# EAGLE design Sound (EAGLE 9.6.2)
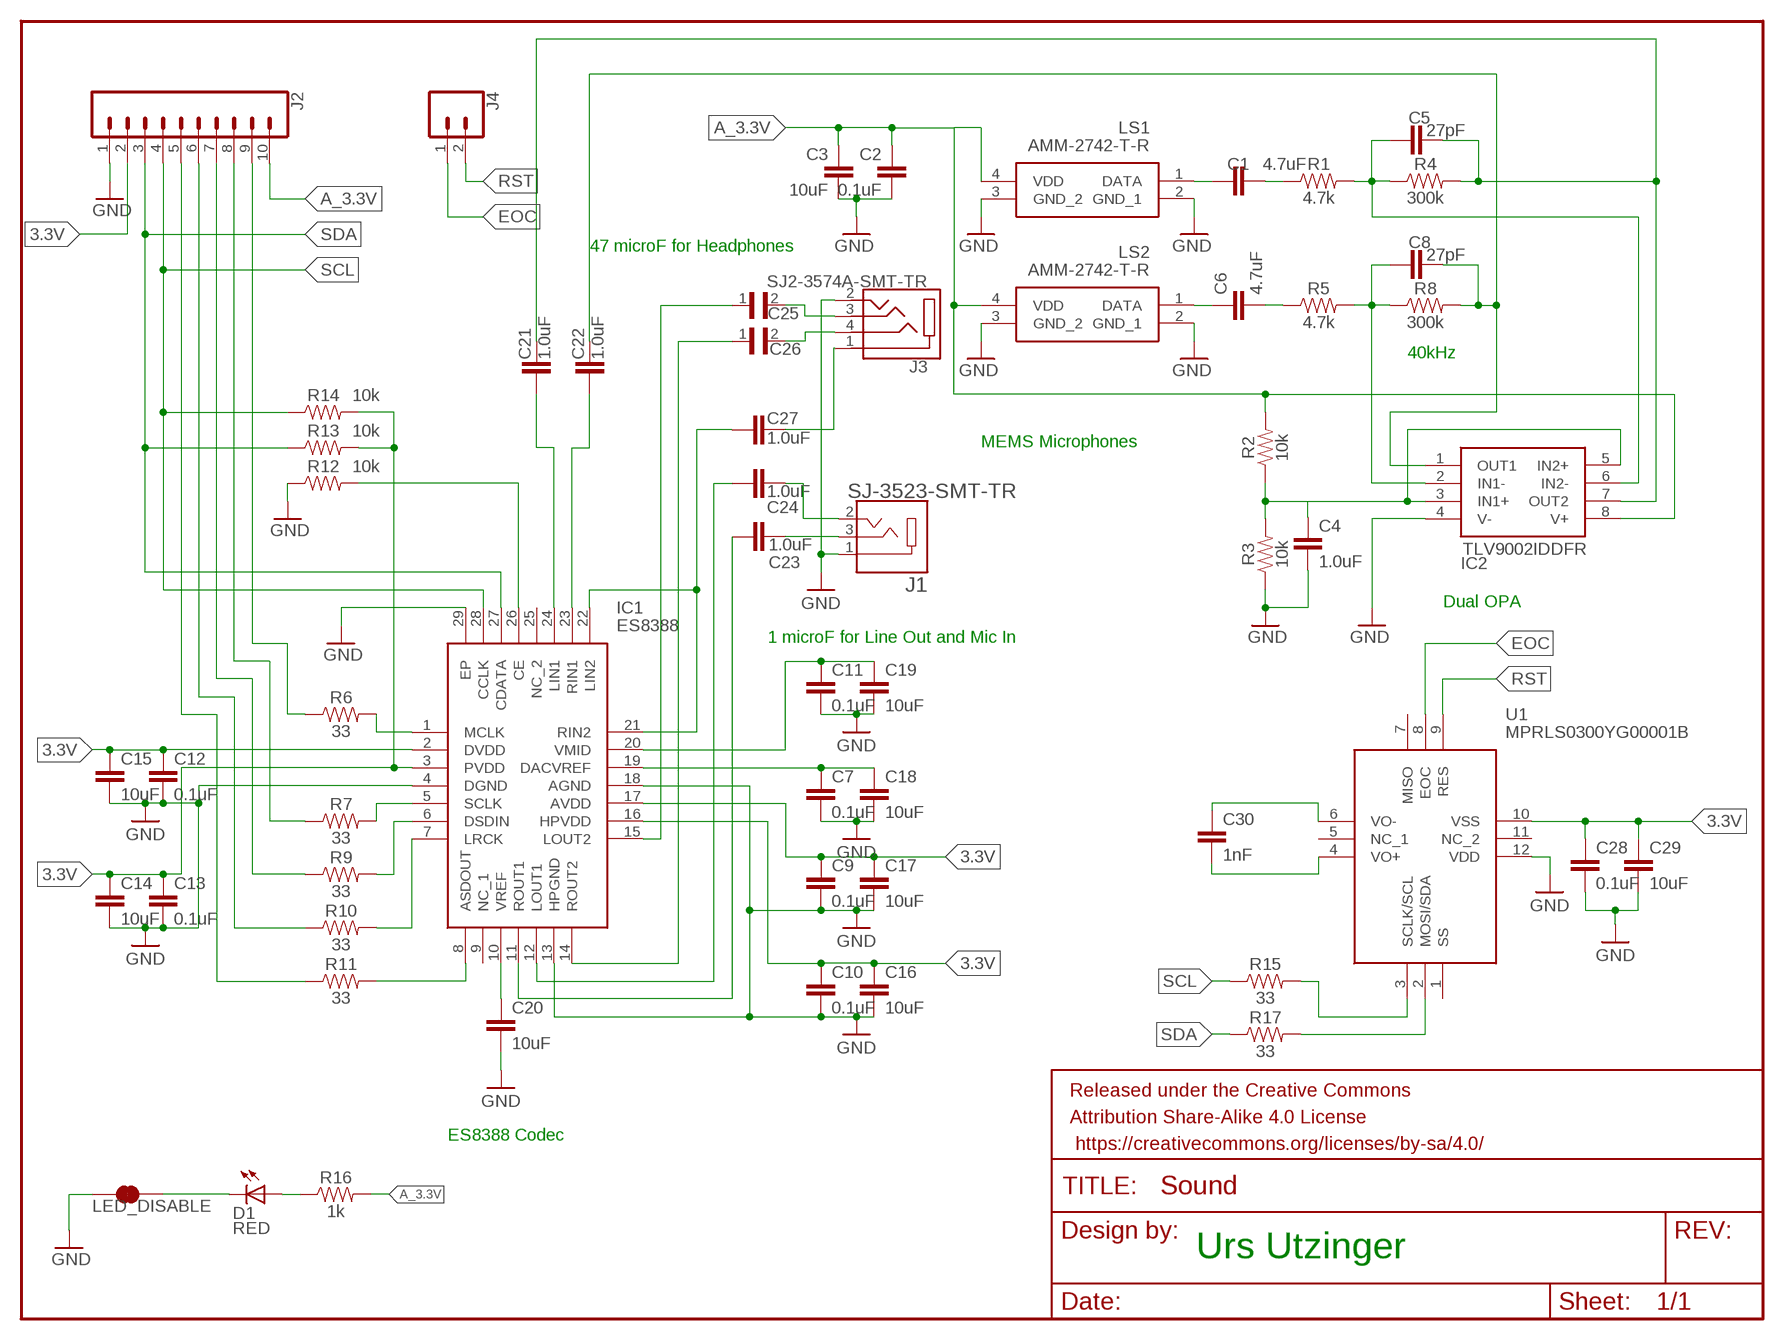
[diagram p0: schematic, sheet 1]

## Parts
C1  4.7uF  4.7UF-0603-6.3V-(10%)  [0603]
C2  0.1uF  0.1UF-0603-25V-5%  [0603]
C3  10uF  10UF-0603-6.3V-20%  [0603]
C4  1.0uF  1.0UF-0603-16V-10%  [0603]
C5  27pF  27PF-0603-50V-5%  [0603]
C6  4.7uF  4.7UF-0603-6.3V-(10%)  [0603]
C7  0.1uF  0.1UF-0603-25V-5%  [0603]
C8  27pF  27PF-0603-50V-5%  [0603]
C9  0.1uF  0.1UF-0603-25V-5%  [0603]
C10  0.1uF  0.1UF-0603-25V-5%  [0603]
C11  0.1uF  0.1UF-0603-25V-5%  [0603]
C12  0.1uF  0.1UF-0603-25V-5%  [0603]
C13  0.1uF  0.1UF-0603-25V-5%  [0603]
C14  10uF  10UF-0603-6.3V-20%  [0603]
C15  10uF  10UF-0603-6.3V-20%  [0603]
C16  10uF  10UF-0603-6.3V-20%  [0603]
C17  10uF  10UF-0603-6.3V-20%  [0603]
C18  10uF  10UF-0603-6.3V-20%  [0603]
C19  10uF  10UF-0603-6.3V-20%  [0603]
C20  10uF  10UF-0603-6.3V-20%  [0603]
C21  1.0uF  1.0UF-0603-16V-10%  [0603]
C22  1.0uF  1.0UF-0603-16V-10%  [0603]
C23  1.0uF  1.0UF-0603-16V-10%  [0603]
C24  1.0uF  1.0UF-0603-16V-10%  [0603]
C25  GRM188R60J476ME15D  [CAPC1608X100N]
C26  GRM188R60J476ME15D  [CAPC1608X100N]
C27  1.0uF  1.0UF-0603-16V-10%  [0603]
C28  0.1uF  0.1UF-0603-25V-5%  [0603]
C29  10uF  10UF-0603-6.3V-20%  [0603]
C30  1nF  1.0NF/1000PF-0603-50V-10%  [0603]
D1  RED  LED-RED0603  [LED-0603]
FRAME1  FRAME-LETTERNO_PACKAGE  [DUMMY]
IC1  ES8388  [QFN45P400X400X90-29N]
IC2  TLV9002IDDFR  [SOT65P280X110-8N]
J1  SJ-3523-SMT-TR  [CUI_SJ-3523-SMT-TR]
J2  CONN_10"  [1X10]
J3  SJ2-3574A-SMT-TR  [CUI_SJ2-3574A-SMT-TR]
J4  CONN_02  [1X02]
LED_DISABLE  JUMPER-SMT_2_NC_TRACE_SILK  [SMT-JUMPER_2_NC_TRACE_SILK]
LS1  AMM-2742-T-R  [AMM2742TR]
LS2  AMM-2742-T-R  [AMM2742TR]
R1  4.7k  4.7KOHM-0603-1/10W-1%  [0603]
R2  10k  10KOHM-0603-1/10W-1%  [0603]
R3  10k  10KOHM-0603-1/10W-1%  [0603]
R4  300k  300KOHM-0603-1/10W-1%  [0603]
R5  4.7k  4.7KOHM-0603-1/10W-1%  [0603]
R6  33  33OHM-0603-1/10W-1%  [0603]
R7  33  33OHM-0603-1/10W-1%  [0603]
R8  300k  300KOHM-0603-1/10W-1%  [0603]
R9  33  33OHM-0603-1/10W-1%  [0603]
R10  33  33OHM-0603-1/10W-1%  [0603]
R11  33  33OHM-0603-1/10W-1%  [0603]
R12  10k  10KOHM-0603-1/10W-1%  [0603]
R13  10k  10KOHM-0603-1/10W-1%  [0603]
R14  10k  10KOHM-0603-1/10W-1%  [0603]
R15  33  33OHM-0603-1/10W-1%  [0603]
R16  1k  1KOHM-0603-1/10W-1%  [0603]
R17  33  33OHM-0603-1/10W-1%  [0603]
U1  MPRLS0300YG00001B  [MPRLS0300YG00001B]

## Nets
3.3V: C9.1 C10.1 C12.1 C13.1 C14.1 C15.1 C16.1 C17.1 C28.1 C29.1 IC1.2(DVDD) IC1.3(PVDD) IC1.16(HPVDD) IC1.17(AVDD) J2.2 R13.2 R14.2 U1.10(VSS)
A_3.3V: C2.1 C3.1 IC2.8(V+) J2.10 LS1.4(VDD) LS2.4(VDD) R2.2 R16.2
DIN: J2.7 R9.1
DOUT: J2.5 R11.1
EOC: J4.1 U1.8(EOC)
GND: C2.2 C3.2 C4.2 C7.2 C9.2 C10.2 C11.2 C12.2 C13.2 C14.2 C15.2 C16.2 C17.2 C18.2 C19.2 C20.2 C28.2 C29.2 IC1.4(DGND) IC1.13(HPGND) IC1.18(AGND) IC1.29(EP) IC2.4(V-) J1.1 J2.1 J3.2 LED_DISABLE.1 LS1.2(GND_1) LS1.3(GND_2) LS2.2(GND_1) LS2.3(GND_2) R3.1 R12.1 U1.12(VDD)
LRCLK: J2.6 R10.1
MCLK: J2.9 R6.1
N$1: IC1.26(CE) R12.2
N$2: C8.2 C22.2 IC2.1(OUT1) R8.2
N$3: C22.1 IC1.23(RIN1)
N$4: C21.1 IC1.24(LIN1)
N$6: R17.2 U1.2(MOSI/SDA)
N$7: R15.2 U1.3(SCLK/SCL)
N$8: C11.1 C19.1 IC1.20(VMID)
N$9: C30.1 U1.6(VO-)
N$10: C5.2 C21.2 IC2.7(OUT2) R4.2
N$11: C30.2 U1.4(VO+)
N$12: C1.1 LS1.1(DATA)
N$14: C1.2 R1.1
N$15: C5.1 IC2.6(IN2-) R1.2 R4.1
N$16: C4.1 IC2.3(IN1+) IC2.5(IN2+) R2.1 R3.2
N$18: C6.1 LS2.1(DATA)
N$19: C6.2 R5.1
N$20: C8.1 IC2.2(IN1-) R5.2 R8.1
N$21: IC1.8(ASDOUT) R11.2
N$22: IC1.7(LRCK) R10.2
N$23: C20.1 IC1.10(VREF)
N$24: IC1.6(DSDIN) R9.2
N$25: IC1.5(SCLK) R7.2
N$26: D1.A R16.1
N$27: IC1.1(MCLK) R6.2
N$28: D1.C LED_DISABLE.2
N$29: C23.2 IC1.11(ROUT1)
N$30: C24.1 J1.2
N$31: C7.1 C18.1 IC1.19(DACVREF)
N$32: C24.2 IC1.12(LOUT1)
N$34: C25.2 J3.3
N$35: C23.1 J1.3
N$36: C26.2 J3.4
N$37: C27.2 J3.1
N$38: C27.1 IC1.21(RIN2) IC1.22(LIN2)
N$39: C26.1 IC1.14(ROUT2)
N$40: C25.1 IC1.15(LOUT2)
RST: J4.2 U1.9(RES)
SCL: IC1.28(CCLK) J2.4 R14.1 R15.1
SCLK: J2.8 R7.1
SDA: IC1.27(CDATA) J2.3 R13.1 R17.1
Unconnected: IC1.9(NC_1) IC1.25(NC_2) U1.1(SS) U1.5(NC_1) U1.7(MISO) U1.11(NC_2)

## Notes on the sheet
- 47 microF for Headphones
- 40kHz
- MEMS Microphones
- Dual OPA
- 1 microF for Line Out and Mic In
- ES8388 Codec
- Urs Utzinger

## Library data of the parts
C1 C6 = SparkFun-Capacitors:4.7UF: 4.7µF ceramic capacitors A capacitor is a passive two-terminal electrical component used to store electrical energy temporarily in an electric field.; PROD_ID: CAP-08280
C2 C7 C9-C13 C28 = SparkFun-Capacitors:0.1UF: 0.1µF ceramic capacitors A capacitor is a passive two-terminal electrical component used to store electrical energy temporarily in an electric field.; PROD_ID: CAP-08604
C3 C14-C20 C29 = SparkFun-Capacitors:10UF: 10.0µF ceramic capacitors A capacitor is a passive two-terminal electrical component used to store electrical energy temporarily in an electric field.; PROD_ID: CAP-11015
C4 C21-C24 C27 = SparkFun-Capacitors:1.0UF: 1µF ceramic capacitors A capacitor is a passive two-terminal electrical component used to store electrical energy temporarily in an electric field.; PROD_ID: CAP-00868
C5 C8 = SparkFun-Capacitors:27PF: 27pF ceramic capacitors A capacitor is a passive two-terminal electrical component used to store electrical energy temporarily in an electric field.; PROD_ID: CAP-09989
C25 C26 = GRM188R60J476ME15D:GRM188R60J476ME15D: SMD Capacitor X5R(EIA) with Capacitance: 47uF Tol. 20%. Rated Voltage: 6.3Vdc
C30 = SparkFun-Capacitors:1.0NF/1000PF: 1nF/1,000pF ceramic capacitors A capacitor is a passive two-terminal electrical component used to store electrical energy temporarily in an electric field.; PROD_ID: CAP-07886
D1 = SparkFun-LED:LED-RED: Assorted Red LEDs LilyPad 1206- DIO-09912 1206- DIO-00809 0603- DIO-00819; PROD_ID: DIO-00819
FRAME1 = SparkFun-Aesthetics:FRAME-LETTER: Schematic Frame - Letter Standard 8.5x11 US Letter frame; DESIGNER: Nobody; VERSION: v01
IC1 = ES8388:ES8388: Low Power Stereo Audio CODEC With Headphone Amplifier Source: Datasheet <http://www.everest-semi.com/pdf/ES8388 DS.pdf>; DESCRIPTION: Low Power Stereo Audio CODEC With Headphone Amplifier; HEIGHT: 0.9mm; MANUFACTURER_NAME: Everest; MANUFACTURER_PART_NUMBER: ES8388
IC2 = TLV9002IDDFR:TLV9002IDDFR: Operational Amplifiers - Op Amps 2-Channel, 1MHz, RRIO, 1.8V to 5.5V Operational Amplifier for Cost-Optimized Systems 8-SOT-23-THIN -40 to 125 Source: Datasheet <https://www.ti.com/lit/gpn/TLV9002>; ARROW_PART_NUMBER: TLV9002IDDFR; ARROW_PRICE-STOCK: https://www.arrow.com/en/products/tlv9002iddfr/texas-instruments?region=europe; DESCRIPTION: Operational Amplifiers - Op Amps 2-Channel, 1MHz, RRIO, 1.8V to 5.5V Operational Amplifier for Cost-Optimized Systems 8-SOT-23-THIN -40 to 125; HEIGHT: 1.1mm; MANUFACTURER_NAME: Texas Instruments; MANUFACTURER_PART_NUMBER: TLV9002IDDFR; MOUSER_PART_NUMBER: 595-TLV9002IDDFR; MOUSER_PRICE-STOCK: https://www.mouser.co.uk/ProductDetail/Texas-Instruments/TLV9002IDDFR?qs=mAH9sUMRCtuVJ6NmNV%252Bgrw%3D%3D
J1 = SJ-3523-SMT-TR:SJ-3523-SMT-TR: Audio Jack Connector 3.5 mm Low Profile Surface Mount Stereo Jack, 3 Pin Right-Angle; MF: CUI Inc; STANDARD: Manufacturer recommendations
J2 = SparkFun-Connectors:CONN_10: Multi connection point. Often used as Generic Header-pin footprint for 0.1 inch spaced/style header connections On any of the 0.1 inch spaced packages, you can populate with these: Break Away Headers - Straight <https://www.sparkfun.com/products/116> (PRT-00116) Break Away Male Headers - Right Angle <https://www.sparkfun.com/products/553> (PRT-00553) Female Headers <https://www.sparkfun.com/products/115> (PRT-00115) Break Away Headers - Machine Pin <https://www.sparkfun.com/products/117> (PRT-00117) Break Away Female Headers - Swiss Machine Pin <https://www.sparkfun.com/products/743> (PRT-00743) Arduino Stackable Header - 10 Pin <https://www.sparkfun.com/products/11376> (PRT-11376) For SCREWTERMINALS and SPRING TERMINALS visit here: Screw Terimnals on SparkFun.com <https://www.sparkfun.com/search/results?term=Screw+Terminals> (5mm/3.5mm/2.54mm spacing) This device is also useful as a general connection point to wire up your design to another part of your project. Our various solder wires solder well into these plated through hole pads. Hook-Up Wire - Assortment (Stranded, 22 AWG) <https://www.sparkfun.com/products/11375> (PRT-11375) Hook-Up Wire - Assortment (Solid Core, 22 AWG) <https://www.sparkfun.com/products/11367> (PRT-11367) View the entire wire category on our website here <https://www.sparkfun.com/categories/141> Special notes: Molex polarized connector foot print use with SKU : PRT-08231 with associated crimp pins and housings. 1MM SMD Version SKU: PRT-10208 NOTES ON THE VARIANTS LOCK and LOCK_LONGPADS... This footprint was designed to help hold the alignment of a through-hole component (i.e. 6-pin header) while soldering it into place. You may notice that each hole has been shifted either up or down by 0.005 of an inch from it's more standard position (which is a perfectly straight line). This slight alteration caused the pins (the squares in the middle) to touch the edges of the holes. Because they are alternating, it causes a "brace" to hold the component in place. 0.005 has proven to be the perfect amount of "off-center" position when using our standard breakaway headers. Although looks a little odd when you look at the bare footprint, once you have a header in there, the alteration is very hard to notice. Also,if you push a header all the way into place, it is covered up entirely on the bottom side.; PROD_ID: CONN-11563
J3 = SJ2-3574A-SMT-TR:SJ2-3574A-SMT-TR: 3.5 mm, Stereo, Right Angle, Surface Mount (SMT), Audio Jack Connector; MANUFACTURER: CUI; MAXIMUM_PACKAGE_HEIGHT: 5.3 mm; PARTREV: 1.02; STANDARD: Manufacturer Recommendations
J4 = SparkFun-Connectors:CONN_02: Multi connection point. Often used as Generic Header-pin footprint for 0.1 inch spaced/style header connections On any of the 0.1 inch spaced packages, you can populate with these: Break Away Headers - Straight <https://www.sparkfun.com/products/116> (PRT-00116) Break Away Male Headers - Right Angle <https://www.sparkfun.com/products/553> (PRT-00553) Female Headers <https://www.sparkfun.com/products/115> (PRT-00115) Break Away Headers - Machine Pin <https://www.sparkfun.com/products/117> (PRT-00117) Break Away Female Headers - Swiss Machine Pin <https://www.sparkfun.com/products/743> (PRT-00743) For SCREWTERMINALS and SPRING TERMINALS visit here: Screw Terimnals on SparkFun.com <https://www.sparkfun.com/search/results?term=Screw+Terminals> (5mm/3.5mm/2.54mm spacing) This device is also useful as a general connection point to wire up your design to another part of your project. Our various solder wires solder well into these plated through hole pads. Hook-Up Wire - Assortment (Stranded, 22 AWG) <https://www.sparkfun.com/products/11375> (PRT-11375) Hook-Up Wire - Assortment (Solid Core, 22 AWG) <https://www.sparkfun.com/products/11367> (PRT-11367) View the entire wire category on our website here <https://www.sparkfun.com/categories/141> Special notes: Molex polarized connector foot print use with: PRT-08233 with associated crimp pins and housings. 2.54_SCREWTERM for use with PRT-10571. 3.5mm Screw Terminal footprints for PRT-08084 5mm Screw Terminal footprints for use with PRT-08432
LED_DISABLE = SparkFun-Jumpers:JUMPER-SMT_2_NC_TRACE: Normally closed trace jumper This jumper has a trace between two pads so it's normally closed (NC). Use a razor knife to open the connection. For best results follow the IPC guidelines for cutting traces: Cutout at least 0.063 mm (0.005 in). Remove all loose material to clean up the cut area. Seal the cut with an approved epoxy. Reapply solder to reclose the connection.
LS1 LS2 = AMM-2742-T-R:AMM-2742-T-R: Microphones MICROPHONE OMNI -42 DB 2VDC 150uA Source: Datasheet <https://www.mouser.ca/ProductDetail/PUI-Audio/AMM-2742-T-R?qs=sGAEpiMZZMtcsMZaWNSqu0WLuZO5KII9g8HRN6KfqAJAYTCxL65m3w==>; DESCRIPTION: Microphones MICROPHONE OMNI -42 DB 2VDC 150uA; HEIGHT: 0.9mm; MANUFACTURER_NAME: PUI Audio; MANUFACTURER_PART_NUMBER: AMM-2742-T-R; MOUSER_PART_NUMBER: 665-AMM-2742-T-R; MOUSER_PRICE-STOCK: https://www.mouser.co.uk/ProductDetail/PUI-Audio/AMM-2742-T-R?qs=zhx2xqPtQQyJoGop0O%252BpMA%3D%3D
R1 R5 = SparkFun-Resistors:4.7KOHM: 4.7kΩ resistor A resistor is a passive two-terminal electrical component that implements electrical resistance as a circuit element. Resistors act to reduce current flow, and, at the same time, act to lower voltage levels within circuits. - Wikipedia; PROD_ID: RES-07857
R2 R3 R12-R14 = SparkFun-Resistors:10KOHM: 10kΩ resistor A resistor is a passive two-terminal electrical component that implements electrical resistance as a circuit element. Resistors act to reduce current flow, and, at the same time, act to lower voltage levels within circuits. - Wikipedia; PROD_ID: RES-00824
R4 R8 = SparkFun-Resistors:300KOHM: 300kΩ resistor A resistor is a passive two-terminal electrical component that implements electrical resistance as a circuit element. Resistors act to reduce current flow, and, at the same time, act to lower voltage levels within circuits. - Wikipedia; PROD_ID: RES-10809
R6 R7 R9-R11 R15 R17 = SparkFun-Resistors:33OHM: 33Ω resistor A resistor is a passive two-terminal electrical component that implements electrical resistance as a circuit element. Resistors act to reduce current flow, and, at the same time, act to lower voltage levels within circuits. - Wikipedia; PROD_ID: RES-08270
R16 = SparkFun-Resistors:1KOHM: 1kΩ resistor A resistor is a passive two-terminal electrical component that implements electrical resistance as a circuit element. Resistors act to reduce current flow, and, at the same time, act to lower voltage levels within circuits. - Wikipedia; PROD_ID: RES-07856
U1 = MPRLS0300YG00001B:MPRLS0300YG00001B: Board Mount Pressure Sensors Source: Datasheet <https://sensing.honeywell.com/honeywell-sensing-micropressure-board-mount-pressure-mpr-series-datasheet-32332628-c-en.pdf>; DESCRIPTION: Board Mount Pressure Sensors; HEIGHT: 5mm; MANUFACTURER_NAME: Honeywell; MANUFACTURER_PART_NUMBER: MPRLS0300YG00001B; MOUSER_PART_NUMBER: 785-MPRLS0300YG0001B; MOUSER_PRICE-STOCK: https://www.mouser.co.uk/ProductDetail/Honeywell/MPRLS0300YG00001B?qs=MLItCLRbWszf0bln%252B%2FiVCQ%3D%3D

## Board
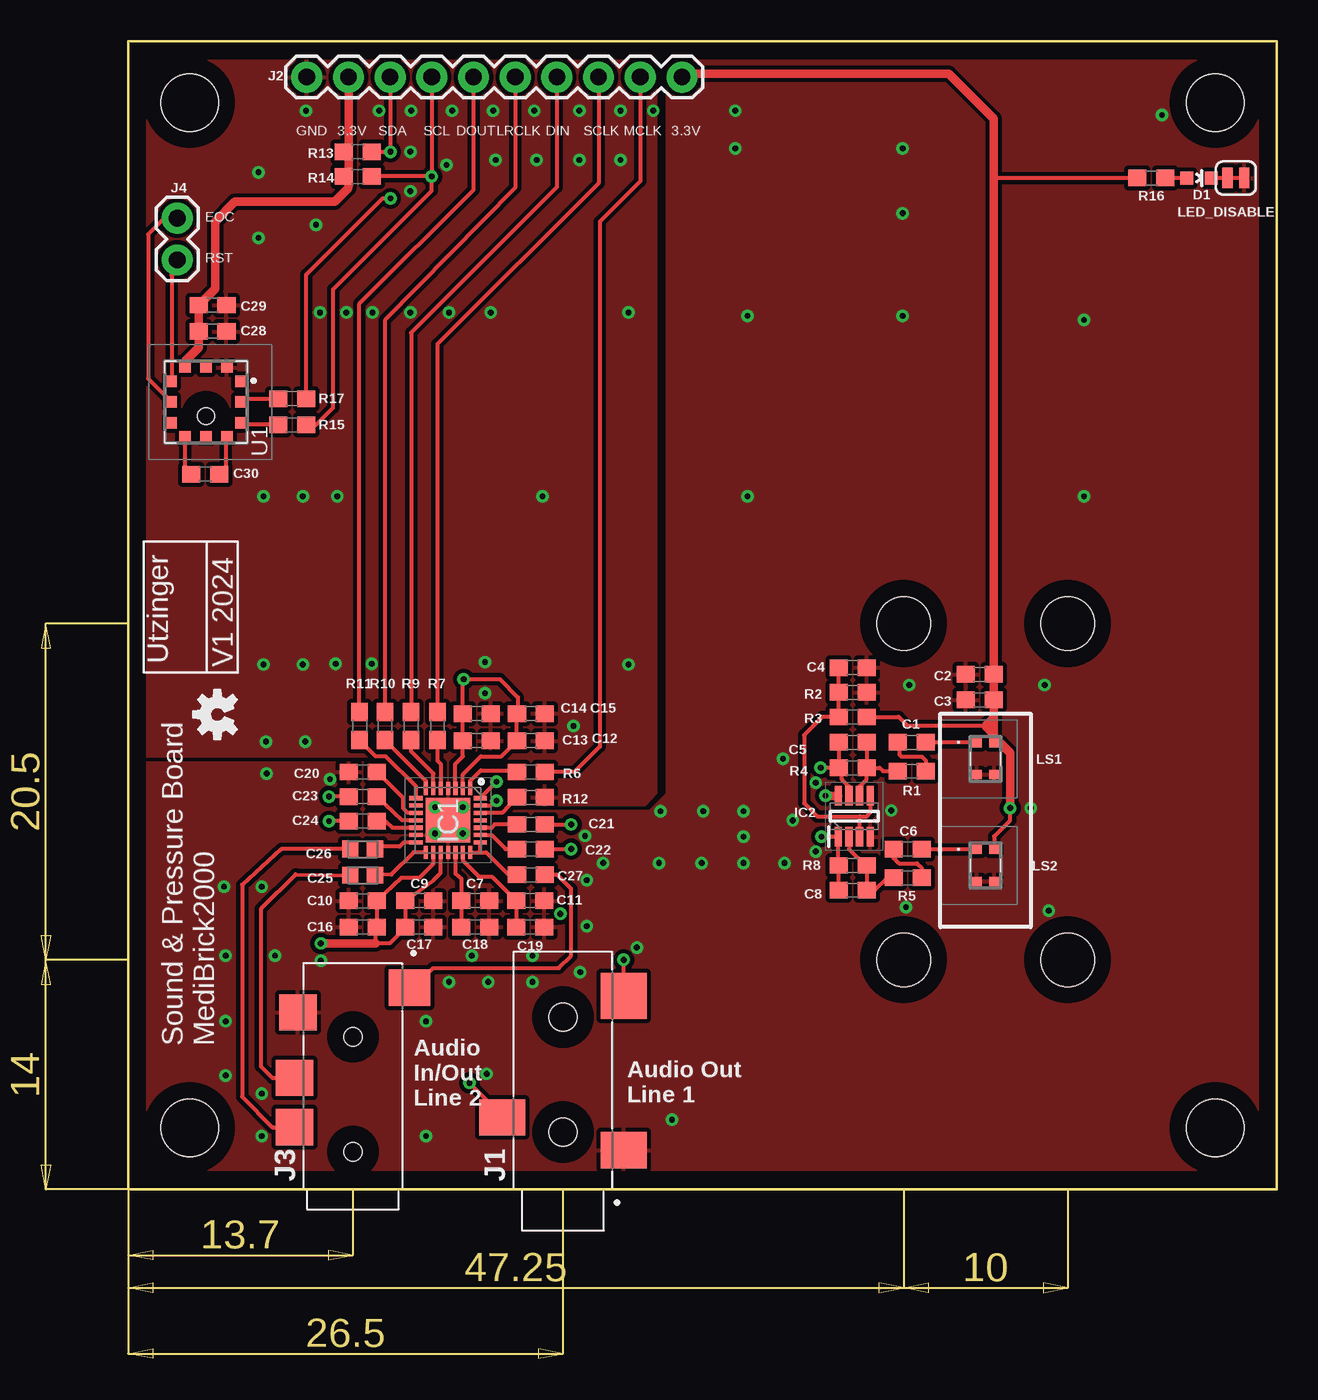
[diagram p1: board, top side]
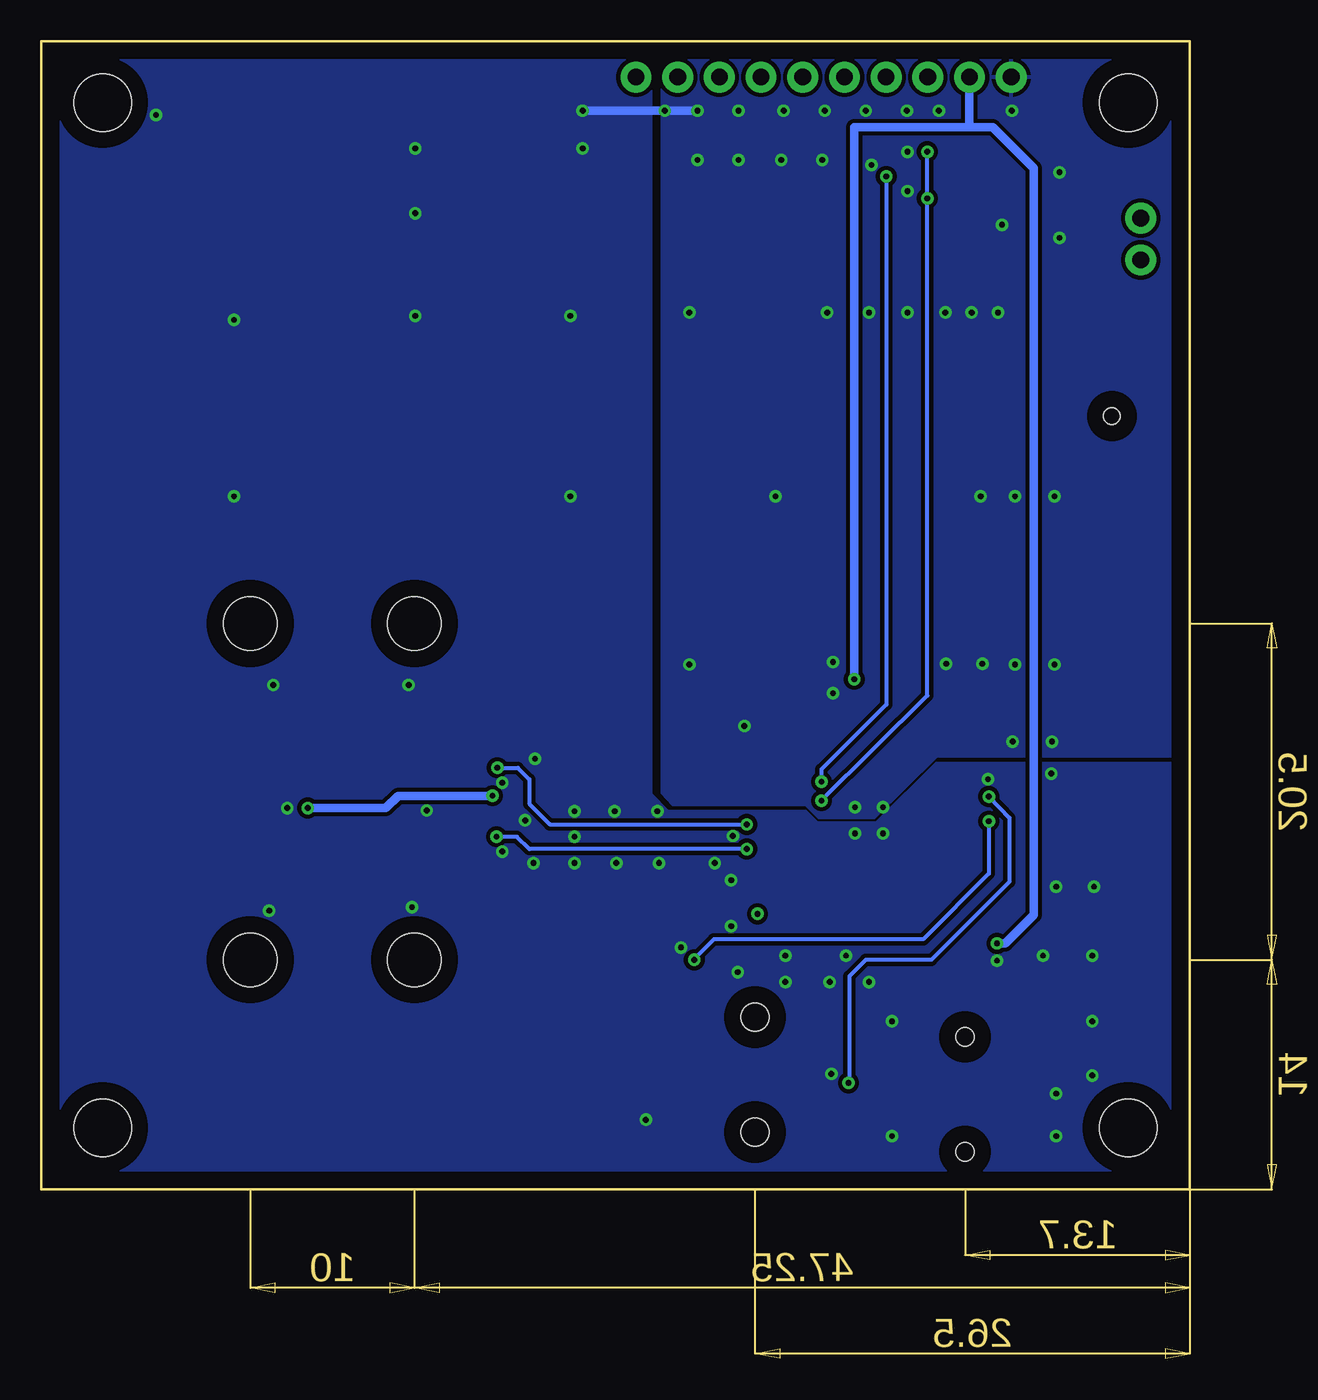
[diagram p2: board, bottom side, seen from below]

Size 70 x 70 mm. Coordinates in mm from the lower left corner, seen from the top.
Outline: 0,0 0,70 70,70 70,0 0,0
Copper layers (1*16): Top 0.035mm / dielectric 1.5mm / Bottom 0.035mm
Design rules "default": minimum track width 6mil, minimum drill 0.35mm, track to track 6mil, track to pad 6mil, pad to pad 6mil, via to via 6mil, smd to smd 6mil, copper to edge 40mil, drill to drill 6mil, minimum pad ring 10mil, minimum via ring 8mil, stop-mask expansion 4mil, vias tented up to drill 0mil, thermal gap 10mil
Holes 3.5 mm at 3.75,66.25 66.25,66.25 66.25,3.75 3.75,3.75
Holes 3.25 mm at 47.25,14 57.25,14 57.25,34.5 47.25,34.5

### Footprints (pad centres in the part's own frame; a part is rotated, then mirrored left to right if it is on the bottom)
0603 = smd 1.1 x 1: 1 -0.85,0; 2 0.85,0
CAPC1608X100N = smd 1 x 1.02: 1 -0.759,0; 2 0.759,0
LED-0603 = smd 0.8 x 0.8: A 0,-0.75; C 0,0.75
QFN45P400X400X90-29N = smd 0.8 x 0.25: 1 -1.95,1.35; 2 -1.95,0.9; 3 -1.95,0.45; 4 -1.95,0; 5 -1.95,-0.45; 6 -1.95,-0.9; 7 -1.95,-1.35; 15 1.95,-1.35; 16 1.95,-0.9; 17 1.95,-0.45; 18 1.95,0; 19 1.95,0.45; 20 1.95,0.9; 21 1.95,1.35 | smd 0.25 x 0.8: 8 -1.35,-1.95; 9 -0.9,-1.95; 10 -0.45,-1.95; 11 0,-1.95; 12 0.45,-1.95; 13 0.9,-1.95; 14 1.35,-1.95; 22 1.35,1.95; 23 0.9,1.95; 24 0.45,1.95; 25 0,1.95; 26 -0.45,1.95; 27 -0.9,1.95; 28 -1.35,1.95 | smd 2.7 x 2.7: 29 0,0
SOT65P280X110-8N = smd 1.2 x 0.45: 1 -1.25,0.975; 2 -1.25,0.325; 3 -1.25,-0.325; 4 -1.25,-0.975; 5 1.25,-0.975; 6 1.25,-0.325; 7 1.25,0.325; 8 1.25,0.975
CUI_SJ-3523-SMT-TR = smd 2.2 x 2.8: 1 -1.1,-3.7; 3 0.9,3.7 | smd 2.8 x 2.8: 2 8.3,-3.7 | hole 1.7: 0,0; 7,0
1X10 = drill 1.016 pad 1.88: 1 0,0; 2 2.54,0; 3 5.08,0; 4 7.62,0; 5 10.16,0; 6 12.7,0; 7 15.24,0; 8 17.78,0; 9 20.32,0; 10 22.86,0
CUI_SJ2-3574A-SMT-TR = smd 2.2 x 2.5: 1 6,-3.45 | smd 2.2 x 2.3: 2 4.5,3.35; 3 0.5,3.55; 4 -2.5,3.55 | hole 1.1: -4,0; 3,0
1X02 = drill 1.016 pad 1.88: 1 0,0; 2 2.54,0
SMT-JUMPER_2_NC_TRACE_SILK = smd 0.635 x 1.27: 1 -0.508,0; 2 0.508,0
AMM2742TR = smd 0.6 x 0.54: 1 -0.525,0.965; 2 -0.525,-0.965; 3 0.525,-0.965; 4 0.525,0.965
MPRLS0300YG00001B = smd 0.7 x 0.65: 1 1.27,-1.85; 2 0,-1.85; 3 -1.27,-1.85; 7 -1.27,2.35; 8 0,2.35; 9 1.27,2.35 | smd 0.65 x 0.7: 4 -2.1,-1.02; 5 -2.1,0.25; 6 -2.1,1.52; 10 2.1,1.52; 11 2.1,0.25; 12 2.1,-1.02 | hole 1: -0.86,0.25

### Placement (x,y rotation side)
C1  47.75,27.25 180 top
C2  51.9,31.4 180 top
C3  51.9,29.85 180 top
C4  44.15,31.8 0 top
C5  44.15,27.25 180 top
C6  47.5,20.75 180 top
C7  21.15,17.6 0 top
C8  44.15,18.25 180 top
C9  17.75,17.6 0 top
C10  14.3,17.6 180 top
C11  24.5,17.6 0 top
C12  24.55,27.35 0 top
C13  21.25,27.35 0 top
C14  21.25,29 0 top
C15  24.55,29 0 top
C16  14.3,16 180 top
C17  17.75,16 0 top
C18  21.15,16 0 top
C19  24.5,16 0 top
C20  14.3,25.45 180 top
C21  24.55,22.25 0 top
C22  24.55,20.75 0 top
C23  14.3,23.95 0 top
C24  14.3,22.45 0 top
C25  14.3,19.15 180 top
C26  14.3,20.75 180 top
C27  24.55,19.18 0 top
C28  5.15,52.3 0 top
C29  5.15,53.9 0 top
C30  4.7,43.6 0 top
D1  65.25,61.65 270 top
FRAME1  -0.25,-5.25 0 top  (outside the outline)
IC1  19.5,22.5 270 top
IC2  44.25,22.75 90 top
J1  26.5,3.5 90 top
J2  10.89,67.8 0 top
J3  13.7,6.3 90 top
J4  3,59.2 270 top
LED_DISABLE  67.5,61.65 180 top
LS1  52.25,26.25 0 top
LS2  52.25,19.75 0 top
R1  47.75,25.5 180 top
R2  44.15,28.8 0 top
R3  44.15,30.3 180 top
R4  44.15,25.7 180 top
R5  47.5,19 180 top
R6  24.55,25.45 180 top
R7  18.85,28.25 270 top
R8  44.15,19.75 180 top
R9  17.25,28.25 270 top
R10  15.65,28.25 270 top
R11  14.1,28.25 270 top
R12  24.55,23.9 180 top
R13  14,63.25 180 top
R14  14,61.75 180 top
R15  10,46.6 180 top
R16  62.35,61.65 180 top
R17  10,48.2 180 top
U1  5,48 90 top
U$3  [OSHW-LOGO-S]  5.45,28.95 90 top

### Tracks (layer width: path | path; a pad name or v marks a point on that pad's centre or on a via)
3.3V  (via drill 0.35)
  Top 0.254: IC1.17 19.05,19.3 18.6,18.85 C9.1 C17.1 16.94,15.99 15.95,15 15.1,15 15.1,15.95 | IC1.16 18.6,19.85 17.75,19 16.65,19 C10.1 C16.1 | IC1.3 19.95,25.95 20.4,26.4 C13.1 C14.1 20.4,31.05 | v20.45,31.1 22.65,31.1 23.75,30 23.75,29.05 | IC1.2 20.4,25.3 21.5,26.4 22.75,26.4 C12.1 C15.1 | R14.2 13.15,61.8 | R13.2 13.45,63.55 | J2.2 13.45,67.78
  Top 0.508: 20.4,31.05 v20.45,31.1 | 23.75,29.05 C15.1 | 15.1,15.95 C16.1 | 15.1,15 v11.75,15 | 13.15,61.8 13.45,62.1 | 13.45,62.1 13.45,62.95 R13.2 | 13.45,67.78 13.45,63.55 | U1.10 3.48,50.48 4.3,51.3 C28.1 C29.1 5.3,54.9 5.3,59 6.5,60.2 12.6,60.2 13.43,61.03 13.45,61.25 13.45,62.1
  Bottom 0.508: v11.75,15 11.25,15 9.5,16.75 9.5,62.25 12,64.75 13.61,64.75 | J2.2 13.43,64.93 13.61,64.75 | v20.45,31.1 20.45,64.75 13.61,64.75
A_3.3V  (via drill 0.35)
  Top 0.254: 52.25,28.25 47.5,28.25 46.95,28.8 R2.2 | v53.75,23.25 53.75,22.5 52.77,21.52 LS2.4 | 52.75,61.6 52.8,61.65 R16.2
  Top 0.508: 52.25,28.25 52.75,28.25 | 52.75,28.75 52.25,28.25 | v53.75,23.25 53.75,26.6 53.13,27.21 LS1.4 52.75,27.75 | 52.75,28.75 C3.1 C2.1 52.75,61.6 52.75,65.25 50,68 33.95,68 J2.10 | 52.75,28.25 52.75,27.75 | 52.75,28.25 52.75,28.75 | 52.25,28.25 52.75,27.75 | IC2.8 v42.5,24
  Bottom 0.508: v42.5,24 48.25,24 49,23.25 v53.75,23.25
DIN
  Top 0.254: J2.7 26.13,61.1 17.25,52.22 R9.1
DOUT
  Top 0.254: R11.1 14.1,54 21.05,60.95 J2.5
EOC
  Top 0.254: J4.1 2.2,59.2 1.22,58.22 1.22,49.43 U1.8
GND  (via drill 0.35)
  Bottom 0.508: v30,65.75 v37,65.75
  other vias: 7.95,62 8.25,42.25 8.25,32 8.4,27.3 58.25,42.25 58.25,53 63,65.5 10.85,65.75 17.25,65.75 19.75,65.75 22.25,65.75 24.75,65.75 27.5,65.75 37.5,21.5 37.5,23.05 47.6,30.75 37.5,19.9 37.75,53.25 37.75,42.25 47.2,53.25 47.2,59.5 47.4,17.2 56.1,17 55,23.25 55.85,30.75 30.5,53.45 30.5,32 25.25,42.25 12.75,42.25 15.3,65.75 27.5,62.75 30,62.75 24.9,62.75 22.4,62.75 14.9,53.45 12.65,32.05 14.85,32.05 21.75,32.15 27.15,28.25 28.95,19.9 21.95,12.65 18.15,10.25 5.95,10.25 18.15,3.25 8.15,3.25 33.15,4.25 32,65.75 46.5,23.1 8.15,5.85 8.15,18.45 5.85,18.45 5.95,6.95 21.75,30.25 18.7,21.7 20.4,21.7 20.4,23.3 18.7,23.3 10.8,27.3 10.65,32 10.65,42.25 11.45,58.8 37,63.45 17.2,63.25 19.4,62.45 47.2,63.45 12.3,25 11.75,13.95 31,14.75 21.85,7.05 27.85,21.55 41.9,24.8 41.9,20.6 32.35,19.9 34.95,19.9 35.05,23.05 32.45,23.05 40.5,22.5 39.9,26.25 40,19.9 5.95,14.25 8.95,14.25 27.55,13.25 27.95,18.85 27.95,16.05 24.65,12.65 19.55,12.65 20.95,14.25 24.65,14.25 8.45,25.35 7.95,58 13.3,53.45 11.7,53.45 17.2,53.45 19.55,53.45 22.1,53.45 17.2,60.85
  pour Bottom (isolate 0.254): 32.8,70 32.8,24.1 31.8,23.1 23.4,23.1 22.7,22.4 19.1,22.4 15.46,26.04 0,26.04 0,0 70,0 70,70
  pour Bottom (isolate 0.254): 0,70 32.2,70 32.2,24.16 31.5,23.4 23.4,23.4 22.6,22.6 19.23,22.6 15.42,26.35 0,26.35
  pour Top (isolate 0.254): 0,70 32.2,70 32.2,24.16 31.5,23.4 23.4,23.4 22.6,22.6 18.9,22.6 18.1,23.4 17.55,23.95 17.55,24.4 15.73,26.35 0,26.35
  pour Top (isolate 0.254): 32.8,70 32.8,24.1 31.8,23.1 23.4,23.1 22.7,22.4 18.69,22.4 15.45,26.05 -0.01,26.05 0,0 70,0 70,70
LRCLK
  Top 0.254: J2.6 23.59,61.05 15.65,52.99 R10.1
MCLK
  Top 0.254: J2.9 31.21,61.46 28.75,59 28.75,27 27.2,25.45 R6.1
N$1
  Top 0.254: IC1.26 21.49,22.95 22.79,22.95 R12.2
N$2  (via drill 0.35)
  Top 0.254: C8.2 R8.2 43.25,21.48 IC2.1 v42.25,21.5 | C22.2 v27,20.75
  Bottom 0.254: v27,20.75 40.25,20.75 41,21.5 v42.25,21.5
N$3
  Top 0.254: IC1.23 22.15,21.6 23,20.75 C22.1
N$4
  Top 0.254: IC1.24 22.17,22.05 22.32,22.25 C21.1
N$5  (via drill 0.35 pad 0.55)
  other vias: 26.34,16.8
N$6
  Top 0.254: U1.2 7.05,48.2 R17.2
N$7
  Top 0.254: U1.3 6.95,46.63 9.12,46.63 R15.2
N$8
  Top 0.254: IC1.20 20.4,20.05 21.4,19.05 22.2,19.05 C11.1 C19.1
N$9
  Top 0.254: C30.1 3.48,43.97 U1.6
N$10  (via drill 0.35)
  Top 0.254: C5.2 R4.2 | IC2.7 43.92,24.57 43.5,25 43.5,25.5 R4.2 | R4.2 v42.2,25.7 | C21.2 v27,22.25
  Bottom 0.254: v42.2,25.7 40.95,25.7 40.25,25 40.25,23.5 39,22.25 v27,22.25
N$11
  Top 0.254: C30.2 5.95,44 5.95,45.9 U1.4
N$12
  Top 0.152: LS1.1 51.69,27.25
  Top 0.254: 51.69,27.25 C1.1
N$14
  Top 0.254: C1.2 47,27.15 47,26.5 47.12,26.38 48.37,26.38 48.6,26.15 R1.1
N$15
  Top 0.254: C5.1 R4.1 | IC2.6 44.58,24.57 45,25 R4.1 | R4.1 45.8,25.7 46,25.5 R1.2
N$16
  Top 0.152: 44.58,22.73 44.6,22.75
  Top 0.254: C4.1 R3.2 R2.1 42.3,28.8 41.2,27.7 41.2,23.55 42,22.75 44.6,22.75 45,22.75 45.25,23 45.25,23.98 IC2.5 | IC2.3 44.58,22.73
N$18
  Top 0.254: LS2.1 48.38,20.71 C6.1
N$19
  Top 0.254: C6.2 46.65,20.2 46.97,19.88 48.07,19.88 48.35,19.6 R5.1
N$20
  Top 0.254: IC2.2 43.93,21.45 43.93,20.73 44.95,19.75 R8.1 C8.1 45.5,18.25 46.25,19 R5.2
N$21
  Top 0.254: IC1.8 17.55,24.55 15.7,26.4 15.1,26.4 R11.2
N$22
  Top 0.254: IC1.7 18.15,24.9 R10.2
N$23
  Top 0.254: IC1.10 17.03,22.95 16.78,23.22 16.78,23.87 15.2,25.45 C20.1
N$24
  Top 0.254: IC1.6 18.6,25.35 17.25,26.7 R9.2
N$25
  Top 0.254: R7.2 18.85,26.15 19.05,25.95 IC1.5
N$26
  Top 0.254: D1.A R16.1
N$27
  Top 0.254: IC1.1 20.85,24.9 21.5,25.55 23.6,25.55 R6.2
N$28
  Top 0.254: LED_DISABLE.2 D1.C
N$29
  Top 0.254: C23.2 16.7,22.5 IC1.11
N$30  (via drill 0.35)
  Top 0.254: C24.1 v12.25,22.45 | J1.2 v30.2,14
  Bottom 0.254: v12.25,22.45 12.25,19.25 16.25,15.25 29,15.25 30.2,14.05 v30.2,14
N$31
  Top 0.254: IC1.19 19.95,19.26 20.3,18.95 C7.1 C18.1
N$32
  Top 0.254: IC1.12 17.5,22.05 16.13,22.05 15.68,22.45 C24.2
N$34
  Top 0.254: C25.2 10.21,19.21 8.1,17.1 8.1,7.5 8.8,6.8 J3.3
N$35  (via drill 0.35)
  Top 0.254: C23.1 v12.25,23.95 | J1.3 22.65,4.65 v20.8,6.5
  Bottom 0.254: v12.25,23.95 11,22.65 11,18.75 15.75,14 19.75,14 20.75,13 20.75,6.55 v20.8,6.5
N$36
  Top 0.254: C26.2 9.35,20.75 6.95,18.57 6.95,5.65 8.8,3.8 J3.4
N$37
  Top 0.254: C27.2 26.15,19.18 27,18.32 27,14.25 26.25,13.5 19,13.5 18.75,13.5 18.6,13.5 17.4,12.3 J3.1
N$38
  Top 0.254: IC1.21 21.48,20.55 | 21.48,20.55 21.82,20.55 23.2,19.18 C27.1 | 21.48,20.55 21.48,21.12 IC1.22
N$39
  Top 0.254: C26.1 15.06,20.9 16.55,20.9 16.8,21.15 IC1.14
N$40
  Top 0.254: IC1.15 17.4,20.55 16.05,19.2 C25.1
RST
  Top 0.254: J4.2 3,56.06 2.65,55.71 U1.9
SCL  (via drill 0.35)
  Top 0.254: v22.45,24.85 IC1.28 | v18.5,61.75 R14.1 | J2.4 v18.51,61.76 v18.5,61.75 | R15.1 11.45,46.6 12.5,47.65 12.5,54.87 18.5,60.87 v18.5,61.75
  Bottom 0.254: v18.5,61.75 18.5,29.55 22.45,25.6 v22.45,24.85
SCLK
  Top 0.254: J2.8 28.67,61.35 18.85,51.53 R7.1
SDA  (via drill 0.35)
  Top 0.254: IC1.27 22.1,23.4 v22.45,23.7 | R13.1 v16,63.25 15.97,63.28 J2.3 | R17.1 10.85,55.75 15.5,60.4 v16,60.4
  Bottom 0.254: v16,63.25 v16,60.4 16,30.1 v22.45,23.7

### Text on the board
tPlace: EOC | RST | Audio / In/Out / Line 2 | Audio Out / Line 1
tNames: GND | 3.3V | SDA | SCL | DOUT | LRCLK | DIN | SCLK | MCLK | 3.3V | Utzinger | V1 2024 | Sound & Pressure Board / MediBrick2000